# EAGLE design balancewheel (EAGLE 7.2.0)
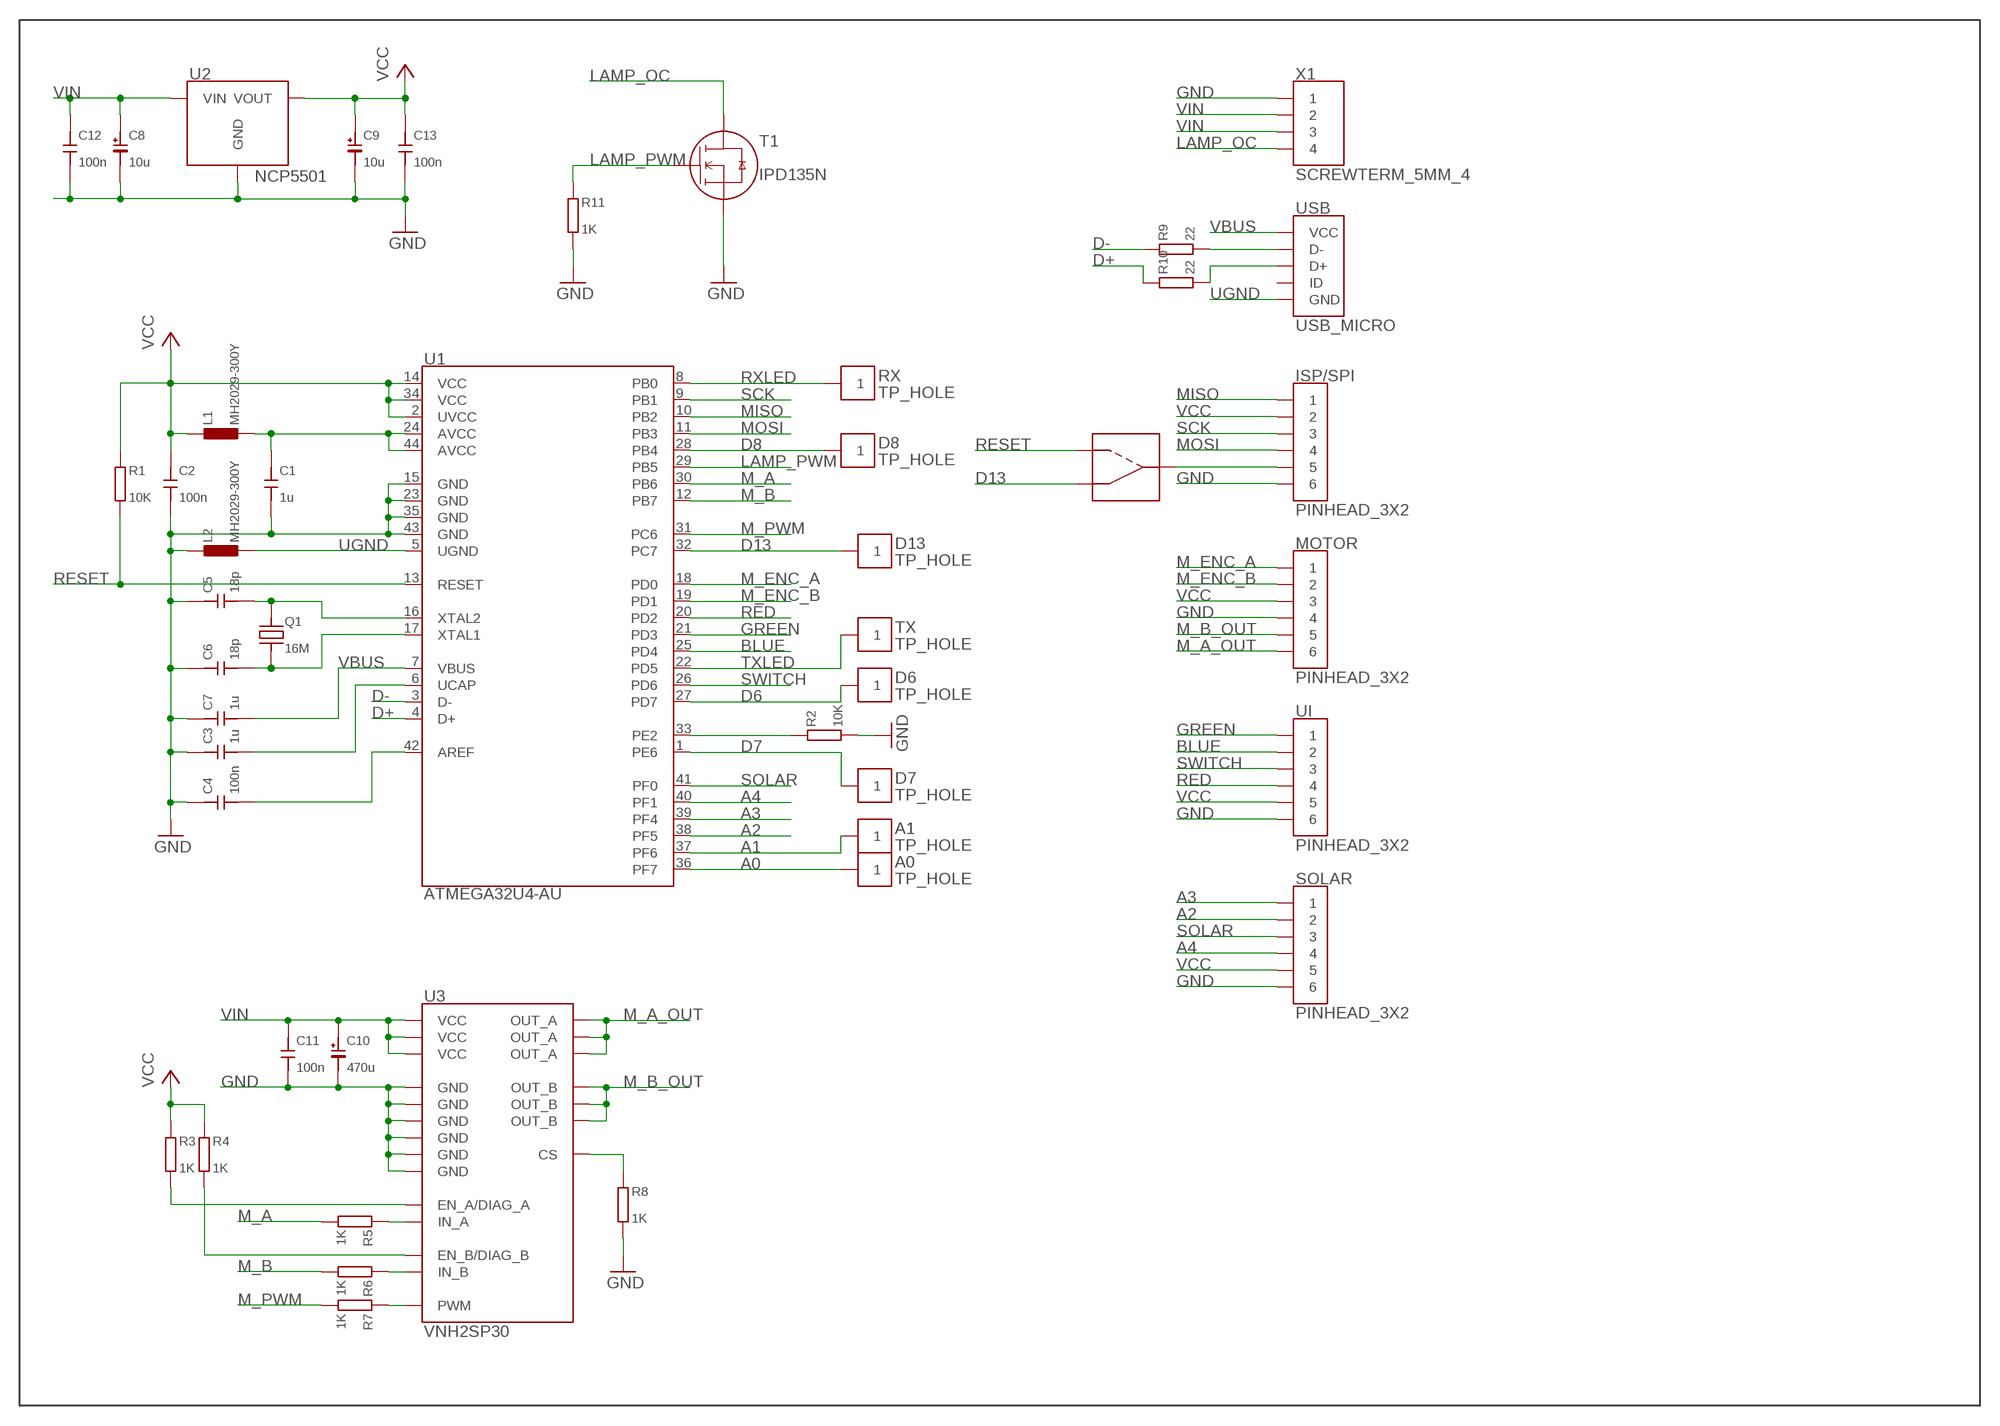
[diagram p0: schematic, sheet 1]

## Parts
A0  TP_HOLE  [X1]
A1  TP_HOLE  [X1]
C1  1u  C0805  [0805]
C2  100n  C0805  [0805]
C3  1u  C0805  [0805]
C4  100n  C0805  [0805]
C5  18p  C0805  [0805]
C6  18p  C0805  [0805]
C7  1u  C0805  [0805]
C8  10u  CPOL_C  [CPOL_C]
C9  10u  CPOL_C  [CPOL_C]
C10  470u  CPOL_10  [CPOL_10]
C11  100n  C0805  [0805]
C12  100n  C0805  [0805]
C13  100n  C0805  [0805]
D6  TP_HOLE  [X1]
D7  TP_HOLE  [X1]
D8  TP_HOLE  [X1]
D13  TP_HOLE  [X1]
ISP/SPI  PINHEAD_3X2  [3X2]
L1  MH2029-300Y  L0805  [0805]
L2  MH2029-300Y  L0805  [0805]
MOTOR  PINHEAD_3X2  [3X2]
Q1  16M  Q5X32  [Q5X32]
R1  10K  R0805  [0805]
R2  10K  R0805  [0805]
R3  1K  R0805  [0805]
R4  1K  R0805  [0805]
R5  1K  R0805  [0805]
R6  1K  R0805  [0805]
R7  1K  R0805  [0805]
R8  1K  R0805  [0805]
R9  22  R0805  [0805]
R10  22  R0805  [0805]
R11  1K  R0805  [0805]
RX  TP_HOLE  [X1]
SJ1  SJ  [X3]
SOLAR  PINHEAD_3X2  [3X2]
T1  IPD135N  MOSFET_N_DPAK  [DPAK]
TX  TP_HOLE  [X1]
U1  ATMEGA32U4-AU  [TQFP44]
U2  NCP5501  [DPAK]
U3  VNH2SP30  [MULTIPOWER30]
UI  PINHEAD_3X2  [3X2]
USB  USB_MICRO  [MUSB]
X1  SCREWTERM_5MM_4  [5MMSCREWTERMX4]

## Nets
A0: A0.P$1 U1.36(PF7)
A1: A1.P$1 U1.37(PF6)
A2: SOLAR.2 U1.38(PF5)
A3: SOLAR.1 U1.39(PF4)
A4: SOLAR.4 U1.40(PF1)
BLUE: U1.25(PD4) UI.2
D6: D6.P$1 U1.27(PD7)
D7: D7.P$1 U1.1(PE6)
D8: D8.P$1 U1.28(PB4)
D13: D13.P$1 SJ1.1 U1.32(PC7)
D+: R10.P$2 U1.4(D+)
D-: R9.P$2 U1.3(D-)
GND: C1.P$1 C2.P$1 C3.P$2 C4.P$2 C5.P$2 C6.P$2 C7.P$2 C8.NEG C9.NEG C10.NEG C11.P$1 C12.P$1 C13.P$1 ISP/SPI.6 L2.P$2 MOTOR.4 R2.P$1 R8.P$1 R11.P$1 SOLAR.6 T1.3(S) U1.15(GND) U1.23(GND) U1.35(GND) U1.43(GND) U2.TAB(GND) U3.P$18(GND) U3.P$19(GND) U3.P$20(GND) U3.P$26(GND) U3.P$27(GND) U3.P$28(GND) UI.6 X1.1
GREEN: U1.21(PD3) UI.1
LAMP_OC: T1.TAB(D) X1.4
LAMP_PWM: R11.P$2 T1.1(G) U1.29(PB5)
M_A: R5.P$1 U1.30(PB6)
M_A_OUT: MOTOR.6 U3.P$1(OUT_A) U3.P$25(OUT_A) U3.P$30(OUT_A)
M_B: R6.P$1 U1.12(PB7)
M_B_OUT: MOTOR.5 U3.P$15(OUT_B) U3.P$16(OUT_B) U3.P$21(OUT_B)
M_ENC_A: MOTOR.1 U1.18(PD0)
M_ENC_B: MOTOR.2 U1.19(PD1)
M_PWM: R7.P$1 U1.31(PC6)
MISO: ISP/SPI.1 U1.10(PB2)
MOSI: ISP/SPI.4 U1.11(PB3)
N$1: C1.P$2 L1.P$1 U1.24(AVCC) U1.44(AVCC)
N$2: C3.P$1 U1.6(UCAP)
N$3: C4.P$1 U1.42(AREF)
N$4: C5.P$1 Q1.P$2 U1.16(XTAL2)
N$5: C6.P$1 Q1.P$1 U1.17(XTAL1)
N$6: R2.P$2 U1.33(PE2)
N$7: R8.P$2 U3.P$9(CS)
N$8: R9.P$1 USB.2(D-)
N$9: R10.P$1 USB.3(D+)
N$11: R3.P$1 U3.P$6(EN_A/DIAG_A)
N$12: R4.P$1 U3.P$10(EN_B/DIAG_B)
N$14: R5.P$2 U3.P$5(IN_A)
N$15: R6.P$2 U3.P$11(IN_B)
N$16: R7.P$2 U3.P$8(PWM)
N$17: ISP/SPI.5 SJ1.2
RED: U1.20(PD2) UI.4
RESET: R1.P$1 SJ1.3 U1.13(RESET)
RXLED: RX.P$1 U1.8(PB0)
SCK: ISP/SPI.3 U1.9(PB1)
SOLAR: SOLAR.3 U1.41(PF0)
SWITCH: U1.26(PD6) UI.3
TXLED: TX.P$1 U1.22(PD5)
UGND: L2.P$1 U1.5(UGND) USB.5(GND)
VBUS: C7.P$1 U1.7(VBUS) USB.1(VCC)
VCC: C2.P$2 C9.POS C13.P$2 ISP/SPI.2 L1.P$2 MOTOR.3 R1.P$2 R3.P$2 R4.P$2 SOLAR.5 U1.2(UVCC) U1.14(VCC) U1.34(VCC) U2.3(VOUT) UI.5
VIN: C8.POS C10.POS C11.P$2 C12.P$2 U2.1(VIN) U3.P$3(VCC) U3.P$13(VCC) U3.P$23(VCC) X1.2 X1.3
Unconnected: USB.4(ID)

## Library data of the parts
A0 A1 D6-D8 D13 RX TX = draradech:TP
C1-C7 C11-C13 = draradech:C
C8-C10 = draradech:CPOL
ISP/SPI MOTOR SOLAR UI = draradech:PINHEAD
L1 L2 = draradech:L
Q1 = draradech:Q
R1-R11 = draradech:R
SJ1 = draradech:SJ
T1 = draradech:MOSFET_N
U1 = draradech:ATMEGA32U4
U2 = draradech:NCP5501
U3 = draradech:VNH2SP30
USB = draradech:USB
X1 = draradech:SCREWTERM

## Board
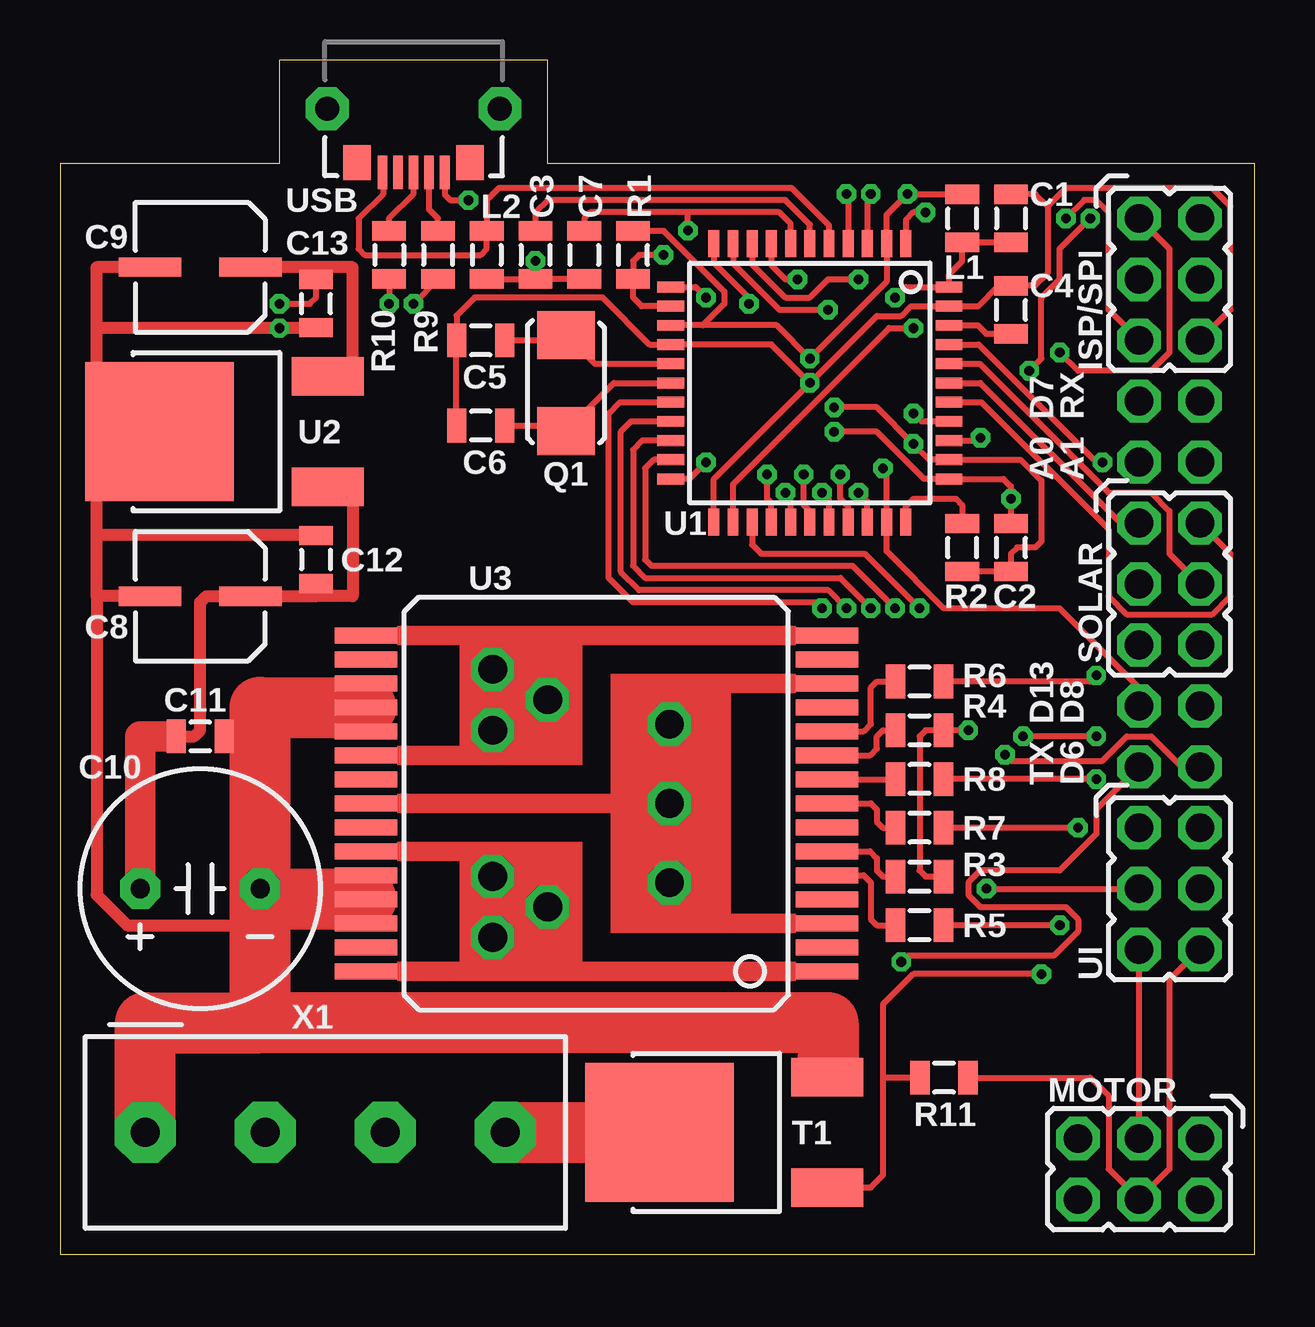
[diagram p1: board, top side]
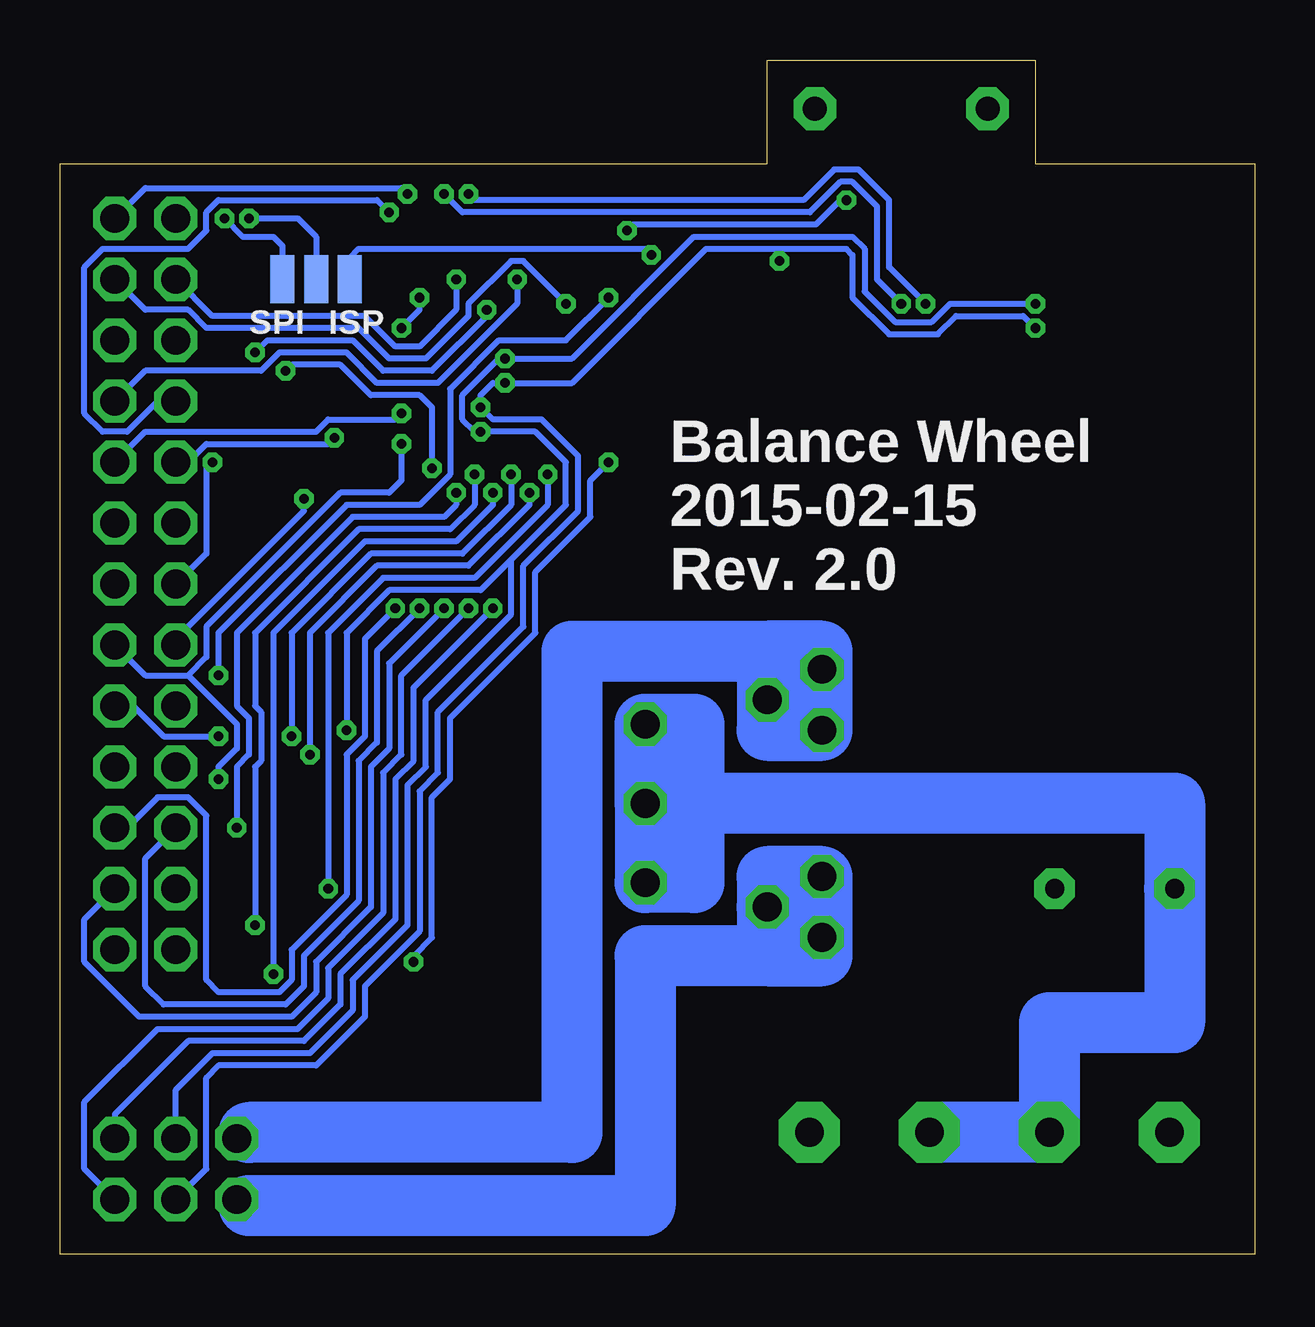
[diagram p2: board, bottom side, seen from below]

Size 49.78 x 49.78 mm. Coordinates in mm from the lower left corner, seen from the top.
Outline: 0,0 49.78,0 49.78,45.47 20.32,45.47 20.32,49.78 9.14,49.78 9.14,45.47 0,45.47 0,0
Copper layers (1*16): Top 0.035mm / dielectric 1.5mm / Bottom 0.035mm
Design rules "default *": minimum track width 10mil, minimum drill 12mil, track to track 8mil, track to pad 8mil, pad to pad 8mil, via to via 8mil, smd to smd 8mil, copper to edge 30mil, drill to drill 8mil, minimum pad ring 10mil, minimum via ring 8mil, stop-mask expansion 4mil, vias tented up to drill 0mil, thermal gap 8mil

### Footprints (pad centres in the part's own frame; a part is rotated, then mirrored left to right if it is on the bottom)
X1 = drill 1.2 octagon: P$1 0,0
0805 = smd 0.8 x 1.4: P$1 -1,0; P$2 1,0
CPOL_C = smd 0.8 x 2.6: NEG 0,2.1; POS 0,-2.1
CPOL_10 = drill 0.8 pad 1.676 octagon: NEG -2.5,0; POS 2.5,0
3X2 = drill 1.2 octagon: 1 2.54,1.27; 2 2.54,-1.27; 3 0,1.27; 4 0,-1.27; 5 -2.54,1.27; 6 -2.54,-1.27
Q5X32 = smd 2 x 2.4: P$1 -2,0; P$2 2,0
X3 = smd 1 x 2: 1 -1.4,0; 2 0,0; 3 1.4,0
DPAK = smd 1.6 x 3: 1 -2.3,-8.1; 3 2.3,-8.1 | smd 5.8 x 6.2: TAB 0,-1.1
TQFP44 = smd 1.118 x 0.457: 1 -5.8,4; 2 -5.8,3.2; 3 -5.8,2.4; 4 -5.8,1.6; 5 -5.8,0.8; 6 -5.8,0; 7 -5.8,-0.8; 8 -5.8,-1.6; 9 -5.8,-2.4; 10 -5.8,-3.2; 11 -5.8,-4; 23 5.8,-4; 24 5.8,-3.2; 25 5.8,-2.4; 26 5.8,-1.6; 27 5.8,-0.8; 28 5.8,0; 29 5.8,0.8; 30 5.8,1.6; 31 5.8,2.4; 32 5.8,3.2; 33 5.8,4 | smd 0.457 x 1.118: 12 -4,-5.8; 13 -3.2,-5.8; 14 -2.4,-5.8; 15 -1.6,-5.8; 16 -0.8,-5.8; 17 0,-5.8; 18 0.8,-5.8; 19 1.6,-5.8; 20 2.4,-5.8; 21 3.2,-5.8; 22 4,-5.8; 34 4,5.8; 35 3.2,5.8; 36 2.4,5.8; 37 1.6,5.8; 38 0.8,5.8; 39 0,5.8; 40 -0.8,5.8; 41 -1.6,5.8; 42 -2.4,5.8; 43 -3.2,5.8; 44 -4,5.8
MULTIPOWER30 = smd 0.68 x 2.6: P$1 -7,-9.6; P$2 -6,-9.6; P$3 -5,-9.6; P$4 -4,-9.6; P$5 -3,-9.6; P$6 -2,-9.6; P$7 -1,-9.6; P$8 0,-9.6; P$9 1,-9.6; P$10 2,-9.6; P$11 3,-9.6; P$12 4,-9.6; P$13 5,-9.6; P$14 6,-9.6; P$15 7,-9.6; P$16 7,9.6; P$17 6,9.6; P$18 5,9.6; P$19 4,9.6; P$20 3,9.6; P$21 2,9.6; P$22 1,9.6; P$23 0,9.6; P$24 -1,9.6; P$25 -2,9.6; P$26 -3,9.6; P$27 -4,9.6; P$28 -5,9.6; P$29 -6,9.6; P$30 -7,9.6
MUSB = smd 0.4 x 1.4: 1 -1.3,2.65; 2 -0.65,2.65; 3 0,2.65; 4 0.65,2.65; 5 1.3,2.65 | smd 1.15 x 1.45: P$6 2.35,2.25; P$7 -2.35,2.25 | drill 1 pad 1.778 octagon: P$8 3.6,0; P$9 -3.6,0
5MMSCREWTERMX4 = drill 1.2 pad 2.54 octagon: 1 0,0; 2 5,0; 3 10,0; 4 15,0

### Placement (x,y rotation side)
A0  44.96,33.02 0 top
A1  47.5,33.02 0 top
C1  39.62,43.18 270 top
C2  39.62,29.46 90 top
C3  19.81,41.66 270 top
C4  39.62,39.37 90 top
C5  17.53,38.1 180 top
C6  17.53,34.54 180 top
C7  21.84,41.66 270 top
C8  5.84,27.43 90 top
C9  5.84,41.15 90 top
C10  5.84,15.24 180 top
C11  5.84,21.59 180 top
C12  10.67,28.96 270 top
C13  10.67,39.62 90 top
D6  47.5,20.32 0 top
D7  44.96,35.56 0 top
D8  47.5,22.86 0 top
D13  44.96,22.86 0 top
ISP/SPI  46.23,40.64 90 top
L1  37.59,43.18 90 top
L2  17.78,41.66 270 top
MOTOR  44.96,3.56 0 top
Q1  21.08,36.32 90 top
R1  23.88,41.66 90 top
R2  37.59,29.46 90 top
R3  35.81,15.75 0 top
R4  35.81,21.84 0 top
R5  35.81,13.72 180 top
R6  35.81,23.88 180 top
R7  35.81,17.78 180 top
R8  35.81,19.81 180 top
R9  15.75,41.66 270 top
R10  13.72,41.66 270 top
R11  36.83,7.37 180 top
RX  47.5,35.56 0 top
SJ1  39.12,40.64 0 bottom
SOLAR  46.23,27.94 90 top
T1  23.88,5.08 90 top
TX  44.96,20.32 0 top
U1  31.24,36.32 270 top
U2  3.05,34.29 90 top
U3  22.35,18.8 90 top
UI  46.23,15.24 90 top
USB  14.73,47.75 180 top
X1  3.56,5.08 0 top

### Tracks (layer width: path | path; a pad name or v marks a point on that pad's centre or on a via)
A0  (via drill 0.4)
  Top 0.254: U1.36 38.24,33.92 v38.35,34.04
  Bottom 0.254: A0.P$1 44.45,33.02 43.69,33.78 38.61,33.78 v38.35,34.04
A1  (via drill 0.4)
  Top 0.254: v35.56,35.05 35.89,34.72 U1.37
  Bottom 0.254: v35.56,35.05 35.81,34.8 38.61,34.8 39.12,34.29 46.23,34.29 A1.P$1
A2
  Top 0.254: U1.38 38.39,35.52 43.69,30.23 43.69,27.43 44.45,26.67 48.01,26.67 48.77,27.43 48.77,29.21 SOLAR.2
A3
  Top 0.254: U1.39 38.35,36.32 44.2,30.48 SOLAR.1
A4
  Top 0.254: U1.40 38.32,37.12 43.69,31.75 45.47,31.75 46.23,30.99 46.23,29.21 SOLAR.4
BLUE  (via drill 0.4)
  Top 0.254: U1.25 28.84,29.58 29.21,29.21 33.53,29.21 v35.81,26.92
  Bottom 0.254: v35.81,26.92 37.08,25.65 37.08,21.59 37.85,20.83 37.85,14.99 40.13,12.7 40.13,11.43 40.64,10.92 43.18,10.92 43.69,11.43 43.69,18.29 44.45,19.05 45.72,19.05 46.99,17.78 UI.2
D6  (via drill 0.4)
  Top 0.254: U1.27 30.44,31.53 v30.23,31.75 | v39.37,20.83 39.62,20.57 43.43,20.57 44.45,21.59 45.47,21.59 46.74,20.32 D6.P$1
  Bottom 0.254: v30.23,31.75 30.23,31.24 32.77,28.7 36.58,28.7 39.37,25.91 v39.37,20.83
D7  (via drill 0.4)
  Top 0.254: v36.07,43.43 35.56,43.43 35.24,43.12 U1.1
  Bottom 0.254: D7.P$1 45.72,35.56 46.99,34.29 48.01,34.29 48.77,35.05 48.77,41.15 48.01,41.91 44.45,41.91 43.69,42.67 43.69,43.43 43.18,43.94 36.58,43.94 v36.07,43.43
D8  (via drill 0.4)
  Top 0.254: U1.28 31.24,30.99 30.99,31.24 v30.99,32.51 | v43.18,21.59 v40.13,21.59
  Bottom 0.254: v30.99,32.51 30.99,31.24 33.02,29.21 36.83,29.21 40.13,25.91 v40.13,21.59 | D8.P$1 46.74,22.86 45.47,21.59 v43.18,21.59
D13  (via drill 0.4)
  Top 0.254: v34.29,32.77 34.44,32.61 U1.32 34.44,29.31 36.83,26.92 41.66,26.92 44.96,23.62 D13.P$1 | v40.39,36.83 40.89,37.34 40.89,39.88 41.66,40.64 41.66,41.91 v42.93,43.18
  Bottom 0.254: v40.39,36.83 40.13,37.08 38.1,37.08 36.83,35.81 34.8,35.81 34.29,35.31 v34.29,32.77 | v42.93,43.18 42.16,42.42 40.89,42.42 40.52,42.04 SJ1.1
D+  (via drill 0.4)
  Top 0.254: R10.P$2 v13.72,39.62 | v32.77,44.2 32.84,44.12 U1.4
  Bottom 0.254: v13.72,39.62 15.24,41.15 15.24,43.94 16.51,45.21 17.53,45.21 18.8,43.94 32.51,43.94 v32.77,44.2
D-  (via drill 0.4)
  Top 0.254: v33.78,44.2 33.64,44.06 U1.3 | v14.73,39.62 15.75,40.64 R9.P$2
  Bottom 0.254: v33.78,44.2 33.02,43.43 18.54,43.43 17.27,44.7 16.76,44.7 15.75,43.69 15.75,40.64 v14.73,39.62
GND  (via drill 0.4)
  Top 0.254: U3.P$26 U3.P$27 U3.P$28 | U3.P$18 U3.P$19 U3.P$20 | U1.23 27.24,32.32 v31.24,36.32 | v31.24,36.32 29.64,37.92 U1.15 24.56,37.92 22.61,39.88 17.27,39.88 16.53,39.13 C5.P$2 16.51,38.08 16.51,34.56 C6.P$2 | v31.24,36.32 34.04,39.12 35.05,39.12 35.46,39.52 U1.43 38.25,39.52 39.1,40.37 C4.P$2 40.62,40.37 41.15,40.89 41.15,43.69 | 21.83,40.64 C7.P$2 C3.P$2 | 41.15,43.69 40.64,44.2 39.64,44.2 C1.P$1 | 32,8.13 32,7.38 T1.3 | v32.26,35.31 34.04,35.31 v35.56,33.78 36.22,33.12 U1.35 40.03,33.12 40.89,32.26 40.89,29.72 40.64,29.46 39.88,29.46 39.62,29.21 C2.P$1 R2.P$1 | UI.6 46.23,11.43 46.23,3.56 MOTOR.4 43.69,3.56 43.69,6.6 42.93,7.37 R11.P$1 | ISP/SPI.6 48.77,39.37 48.77,43.69 48.01,44.45 41.91,44.45 41.15,43.69 | L2.P$2 C3.P$2 | C3.P$2 v19.81,41.4 | v43.18,19.81 R8.P$1
  Top 0.406: 16.51,38.12 C5.P$2
  Top 0.508: 1.52,27.43 1.52,29.97 | 1.52,29.97 1.52,34.29 | 1.52,34.29 1.52,38.61 | 1.52,38.61 1.52,41.15 C9.NEG | C8.NEG 1.52,27.43 | U2.TAB 1.52,34.29 | C12.P$1 10.67,29.97 1.52,29.97 | C13.P$1 10.67,38.61 v9.14,38.61 1.52,38.61 | C11.P$1 8.34,21.59 | 1.52,27.43 1.52,14.99 2.79,13.72 7.87,13.72 8.38,14.22 8.38,15.24 C10.NEG
  Top 2.54: U3.P$27 8.34,14.8 C10.NEG | C10.NEG 8.34,21.59 8.34,22.8 U3.P$19 | X1.1 3.56,9.65 8.34,9.65 | 8.34,9.65 C10.NEG | 8.34,9.65 32,9.65 32,8.13
  Bottom 0.254: MOTOR.4 43.69,3.56 43.69,7.37 43.18,7.87 39.12,7.87 37.08,9.91 37.08,11.18 34.8,13.46 34.8,19.3 34.04,20.07 34.04,22.61 30.48,26.16 30.48,28.7 28.19,30.99 28.19,33.27 29.72,34.8 31.75,34.8 v32.26,35.31 32.26,35.81 31.75,36.32 v31.24,36.32 28.45,36.32 22.86,41.91 19.81,41.91 | v35.56,33.78 35.56,32.26 36.07,31.75 38.1,31.75 43.69,26.16 43.69,24.89 44.45,24.13 | 19.81,41.91 17.02,41.91 16.76,41.66 16.76,39.88 15.24,38.35 13.21,38.35 12.45,39.12 9.65,39.12 v9.14,38.61 | v19.81,41.4 19.81,41.91 | 44.45,24.13 42.42,22.1 42.42,21.08 43.18,20.32 v43.18,19.81 | SOLAR.6 46.23,24.13 44.45,24.13
GREEN  (via drill 0.4)
  Top 0.254: U1.21 24.74,33.12 24.38,32.77 24.38,28.96 24.64,28.7 33.02,28.7 v34.8,26.92
  Bottom 0.254: v34.8,26.92 36.58,25.15 36.58,21.34 37.34,20.57 37.34,14.73 39.62,12.45 39.62,11.18 40.39,10.41 45.47,10.41 46.23,11.18 46.23,16.51 UI.1
LAMP_OC
  Top 2.54: X1.4 T1.TAB
LAMP_PWM  (via drill 0.4)
  Top 0.254: U1.29 32.04,31.46 v31.75,31.75 | v40.89,11.68 35.56,11.68 34.29,10.41 34.29,7.37 | 34.29,7.37 34.29,3.3 33.78,2.79 31.99,2.79 T1.1 | R11.P$2 34.29,7.37
  Bottom 0.254: v31.75,31.75 31.75,31.24 33.27,29.72 37.08,29.72 40.89,25.91 v40.89,11.68
M_A  (via drill 0.4)
  Top 0.254: U1.30 32.84,31.17 32.51,31.5 v32.51,32.51 | v41.66,13.72 R5.P$1
  Bottom 0.254: v32.51,32.51 32.51,31.24 33.53,30.23 37.34,30.23 41.66,25.91 41.66,22.86 41.4,22.61 41.4,20.57 41.66,20.32 v41.66,13.72
M_A_OUT  (via drill 1.2)
  Top 0.254: U3.P$25 18.03,16.8 v18.03,15.75 18.03,14.48 | 18.03,14.48 v18.03,13.21 18.03,11.8 | 18.03,11.8 U3.P$30 | U3.P$1 18.03,11.8 | v20.32,14.48 18.03,14.48
  Bottom 0.254: 41.91,2.03 42.16,2.29 MOTOR.6
  Bottom 2.54: 20.32,12.45 v20.32,14.48 20.32,15.75 v18.03,15.75 18.03,12.45 20.32,12.45 | 20.32,12.45 25.4,12.45 25.4,2.03 41.91,2.03
M_B  (via drill 0.4)
  Top 0.254: U1.12 26.48,40.32 v26.92,39.88 | 36.83,23.89 R6.P$1 42.93,23.88 v43.18,24.13
  Bottom 0.254: v26.92,39.88 28.7,38.1 31.5,38.1 33.53,36.07 33.53,32.51 34.8,31.24 37.85,31.24 43.18,25.91 v43.18,24.13
M_B_OUT  (via drill 1.2)
  Top 0.254: U3.P$16 18.03,25.8 | 18.03,25.8 v18.03,24.38 v18.03,21.84 | U3.P$21 18.03,20.8 v18.03,21.84 | v18.03,21.84 18.03,23.11 v20.32,23.11 | U3.P$15 18.03,25.8
  Bottom 0.254: 41.91,5.08 42.16,4.83 MOTOR.5
  Bottom 2.54: 20.32,25.15 28.45,25.15 28.45,5.08 41.91,5.08 | 20.32,25.15 20.32,21.84 v18.03,21.84 18.03,25.15 20.32,25.15
M_ENC_A  (via drill 0.4)
  Top 0.254: v31.75,26.92 31.5,27.18 23.88,27.18 22.86,28.19 22.86,35.05 23.33,35.52 U1.18
  Bottom 0.254: v31.75,26.92 35.05,23.62 35.05,20.57 35.81,19.81 35.81,13.97 38.1,11.68 38.1,10.41 39.62,8.89 44.45,8.89 47.5,5.84 MOTOR.1
M_ENC_B  (via drill 0.4)
  Top 0.254: v32.77,26.92 32,27.69 24.13,27.69 23.37,28.45 23.37,34.29 23.8,34.72 U1.19
  Bottom 0.254: v32.77,26.92 35.56,24.13 35.56,20.83 36.32,20.07 36.32,14.22 38.61,11.94 38.61,10.67 39.88,9.4 45.72,9.4 48.77,6.35 48.77,3.56 MOTOR.2
M_PWM  (via drill 0.4)
  Top 0.254: U1.31 33.64,31.38 v33.27,31.75 | v42.42,17.78 R7.P$1
  Bottom 0.254: v33.27,31.75 33.27,31.24 33.78,30.73 37.59,30.73 42.42,25.91 42.42,22.86 41.91,22.35 41.91,20.83 42.42,20.32 v42.42,17.78
MISO  (via drill 0.4)
  Top 0.254: U1.10 28.04,41.3 29.97,39.37 v32,39.37 | ISP/SPI.1 46.23,41.91 46.23,37.59 45.47,36.83 42.42,36.83 v41.66,37.59
  Bottom 0.254: v32,39.37 32,39.12 34.29,36.83 36.32,36.83 37.59,38.1 41.15,38.1 v41.66,37.59
MOSI  (via drill 0.4)
  Top 0.254: U1.11 27.24,41.34 28.7,39.88 v28.7,39.62
  Bottom 0.254: v28.7,39.62 30.48,41.4 30.99,41.4 32.77,39.62 32.77,39.12 34.54,37.34 36.07,37.34 37.34,38.61 43.69,38.61 44.45,39.37 46.23,39.37 ISP/SPI.4
N$1  (via drill 0.4)
  Top 0.254: C1.P$2 L1.P$1 37.59,41.4 37.04,40.85 U1.44 35.24,40.32 v34.8,39.88 | U1.24 28.04,32.11 34.54,38.61 v35.56,38.61
  Bottom 0.254: v35.56,38.61 34.8,39.37 v34.8,39.88
N$2
  Top 0.254: U1.6 31.24,42.93 30.23,43.94 20.32,43.94 19.81,43.43 C3.P$1
N$3
  Top 0.254: U1.42 38.24,38.72 38.59,38.37 C4.P$1
N$4
  Top 0.254: C5.P$1 21.08,38.1 Q1.P$2 22.28,37.12 U1.16
N$5
  Top 0.254: C6.P$1 21.08,34.54 Q1.P$1 23.08,36.32 U1.17
N$6
  Top 0.254: U1.33 35.24,31.18 35.56,31.5 37.34,31.5 37.59,31.24 R2.P$2
N$7
  Top 0.254: U3.P$9 34.8,19.8 R8.P$2
N$8
  Top 0.254: R9.P$1 15.75,43.18 15.38,43.55 USB.2
N$9
  Top 0.254: R10.P$1 13.72,43.18 14.73,44.2 USB.3
N$11
  Top 0.254: U3.P$6 33.75,16.8 34.04,16.51 34.04,16 34.29,15.75 R3.P$1
N$12
  Top 0.254: U3.P$10 33.75,20.8 34.04,21.08 34.04,21.59 34.29,21.84 R4.P$1
N$14
  Top 0.254: U3.P$5 33.48,15.8 33.78,15.49 33.78,13.97 34.04,13.72 R5.P$2
N$15
  Top 0.254: U3.P$11 33.48,21.8 33.78,22.1 33.78,23.62 34.04,23.88 R6.P$2
N$16
  Top 0.254: U3.P$8 33.78,18.8 34.04,18.54 34.04,18.03 34.29,17.78 R7.P$2
N$17  (via drill 0.4)
  Top 0.254: ISP/SPI.5 43.69,39.37 43.69,43.43 43.18,43.94 42.67,43.94 v41.91,43.18
  Bottom 0.254: v41.91,43.18 39.88,43.18 39.12,42.42 SJ1.2
RED  (via drill 0.4)
  Top 0.254: U1.20 24.27,33.92 23.88,33.53 23.88,28.7 24.38,28.19 32.51,28.19 v33.78,26.92
  Bottom 0.254: v33.78,26.92 36.07,24.64 36.07,21.08 36.83,20.32 36.83,14.48 39.12,12.19 39.12,10.92 40.13,9.91 46.48,9.91 48.77,12.19 48.77,13.97 UI.4
RESET  (via drill 0.4)
  Top 0.254: U1.13 24.23,39.52 23.88,39.88 R1.P$1 23.88,41.4 24.13,41.66 v25.15,41.66
  Bottom 0.254: v25.15,41.66 25.4,41.91 37.34,41.91 37.72,41.53 SJ1.3
RXLED  (via drill 0.4)
  Top 0.254: U1.8 29.64,41.22 30.23,40.64 v30.73,40.64
  Bottom 0.254: v30.73,40.64 30.73,39.62 34.04,36.32 36.58,36.32 37.85,37.59 40.64,37.59 41.4,36.83 46.23,36.83 RX.P$1
SCK  (via drill 0.4)
  Top 0.254: U1.9 28.84,41.26 30.23,39.88 31.24,39.88 32,40.64 v33.27,40.64
  Bottom 0.254: v33.27,40.64 33.27,39.37 34.8,37.85 35.81,37.85 37.08,39.12 43.43,39.12 ISP/SPI.3
SOLAR  (via drill 0.4)
  Top 0.254: U1.41 38.28,37.92 43.18,33.02 v43.43,33.02
  Bottom 0.254: v43.43,33.02 43.69,32.77 43.69,29.21 SOLAR.3
SWITCH  (via drill 0.4)
  Top 0.254: U1.26 29.64,31.32 29.46,31.5 v29.46,32.51 | v38.61,15.24 UI.3
  Bottom 0.254: v29.46,32.51 29.46,31.24 32.51,28.19 36.32,28.19 38.61,25.91 v38.61,15.24
TXLED  (via drill 0.4)
  Top 0.254: TX.P$1 43.18,18.54 43.18,17.53 41.66,16 38.35,16 37.85,15.49 37.85,14.99 38.35,14.48 41.91,14.48 42.42,13.97 42.42,13.46 41.4,12.45 35.31,12.45 v35.05,12.19 | v26.92,33.02 26.23,32.32 U1.22
  Bottom 0.254: v35.05,12.19 35.05,12.45 34.29,13.21 34.29,19.05 33.53,19.81 33.53,22.35 29.97,25.91 29.97,28.45 27.69,30.73 27.69,32.26 v26.92,33.02
UGND
  Top 0.254: U1.5 32.04,42.89 30.48,44.45 18.29,44.45 17.78,43.94 L2.P$1 17.78,41.91 17.53,41.66 12.7,41.66 12.45,41.91 12.45,43.18 13.46,44.2 13.46,45.07 USB.5
VBUS  (via drill 0.4)
  Top 0.254: U1.7 30.44,42.96 29.97,43.43 26.16,43.43 | 26.16,43.43 22.1,43.43 21.84,43.18 C7.P$1 | v26.16,42.67 26.16,43.43 | USB.1 16.03,44.17 16.26,43.94 v17.02,43.94
  Bottom 0.254: v17.02,43.94 17.27,43.94 18.29,42.93 25.91,42.93 v26.16,42.67
VCC  (via drill 0.4)
  Top 0.254: L1.P$2 37.58,44.2 v35.31,44.2 34.44,43.33 U1.2 34.44,40.54 v31.24,37.34 29.86,38.72 26.78,38.72 | 26.78,38.72 27.69,39.62 27.69,40.13 25.16,42.66 R1.P$2 | 10.67,41.15 C13.P$2 10.67,39.88 10.41,39.62 v9.14,39.62 | C2.P$2 v39.62,31.5 39.62,32 39.31,32.32 U1.34 36,32.32 34.04,34.29 v32.26,34.29 | v37.85,21.84 R4.P$2 36.07,21.84 35.81,21.59 35.81,16 36.07,15.75 R3.P$2 | 26.78,38.72 U1.14 | UI.5 MOTOR.3
  Top 0.508: U2.3 12.19,36.59 12.19,41.15 10.67,41.15 C9.POS
  Bottom 0.254: MOTOR.3 44.96,6.86 43.43,8.38 39.37,8.38 37.59,10.16 37.59,11.43 35.31,13.72 35.31,19.56 34.54,20.32 34.54,23.11 30.99,26.67 30.99,28.96 | 30.99,28.96 32.26,27.69 36.07,27.69 37.85,25.91 v37.85,21.84 | 30.99,28.96 28.7,31.24 28.7,33.02 29.97,34.29 v32.26,34.29 32.51,34.29 33.02,34.8 33.02,35.81 31.5,37.34 v31.24,37.34 28.45,37.34 23.37,42.42 16.76,42.42 16.26,41.91 16.26,40.13 14.99,38.86 13.46,38.86 12.7,39.62 v9.14,39.62 | ISP/SPI.2 46.23,44.45 35.56,44.45 v35.31,44.2 | SOLAR.5 44.96,25.65 39.62,30.99 v39.62,31.5
VIN  (via drill 1.2)
  Top 0.254: U3.P$23 v25.4,18.8 | U3.P$13 25.4,23.8 v25.4,22.1 | U3.P$3 25.4,13.8 v25.4,15.49 | C11.P$2 4.57,21.59
  Top 0.508: U2.1 12.19,31.99 12.19,27.43 10.67,27.43 | 10.67,27.43 C8.POS 6.1,27.43 5.84,27.18 5.84,21.84 5.59,21.59 C11.P$2 | 10.67,27.43 C12.P$2
  Top 1.27: 4.57,21.59 3.34,21.59 C10.POS
  Bottom 2.54: v25.4,18.8 3.34,18.8 C10.POS 3.34,9.65 8.56,9.65 X1.2 X1.3 | v25.4,18.8 v25.4,15.49 23.37,15.49 23.37,22.1 v25.4,22.1 v25.4,18.8

### Text on the board
bNames: ISP | SPI | Balance Wheel / 2015-02-15 / Rev. 2.0